# Altium schematic sheet SCH_WINGLET_BMU.SchDoc: Winglet BMU
size B; DrawnBy: HCAdam; Organization: Aerospace Village; DocumentNumber: WINGLET; Revision: A; SheetNumber: 1; SheetTotal: 10
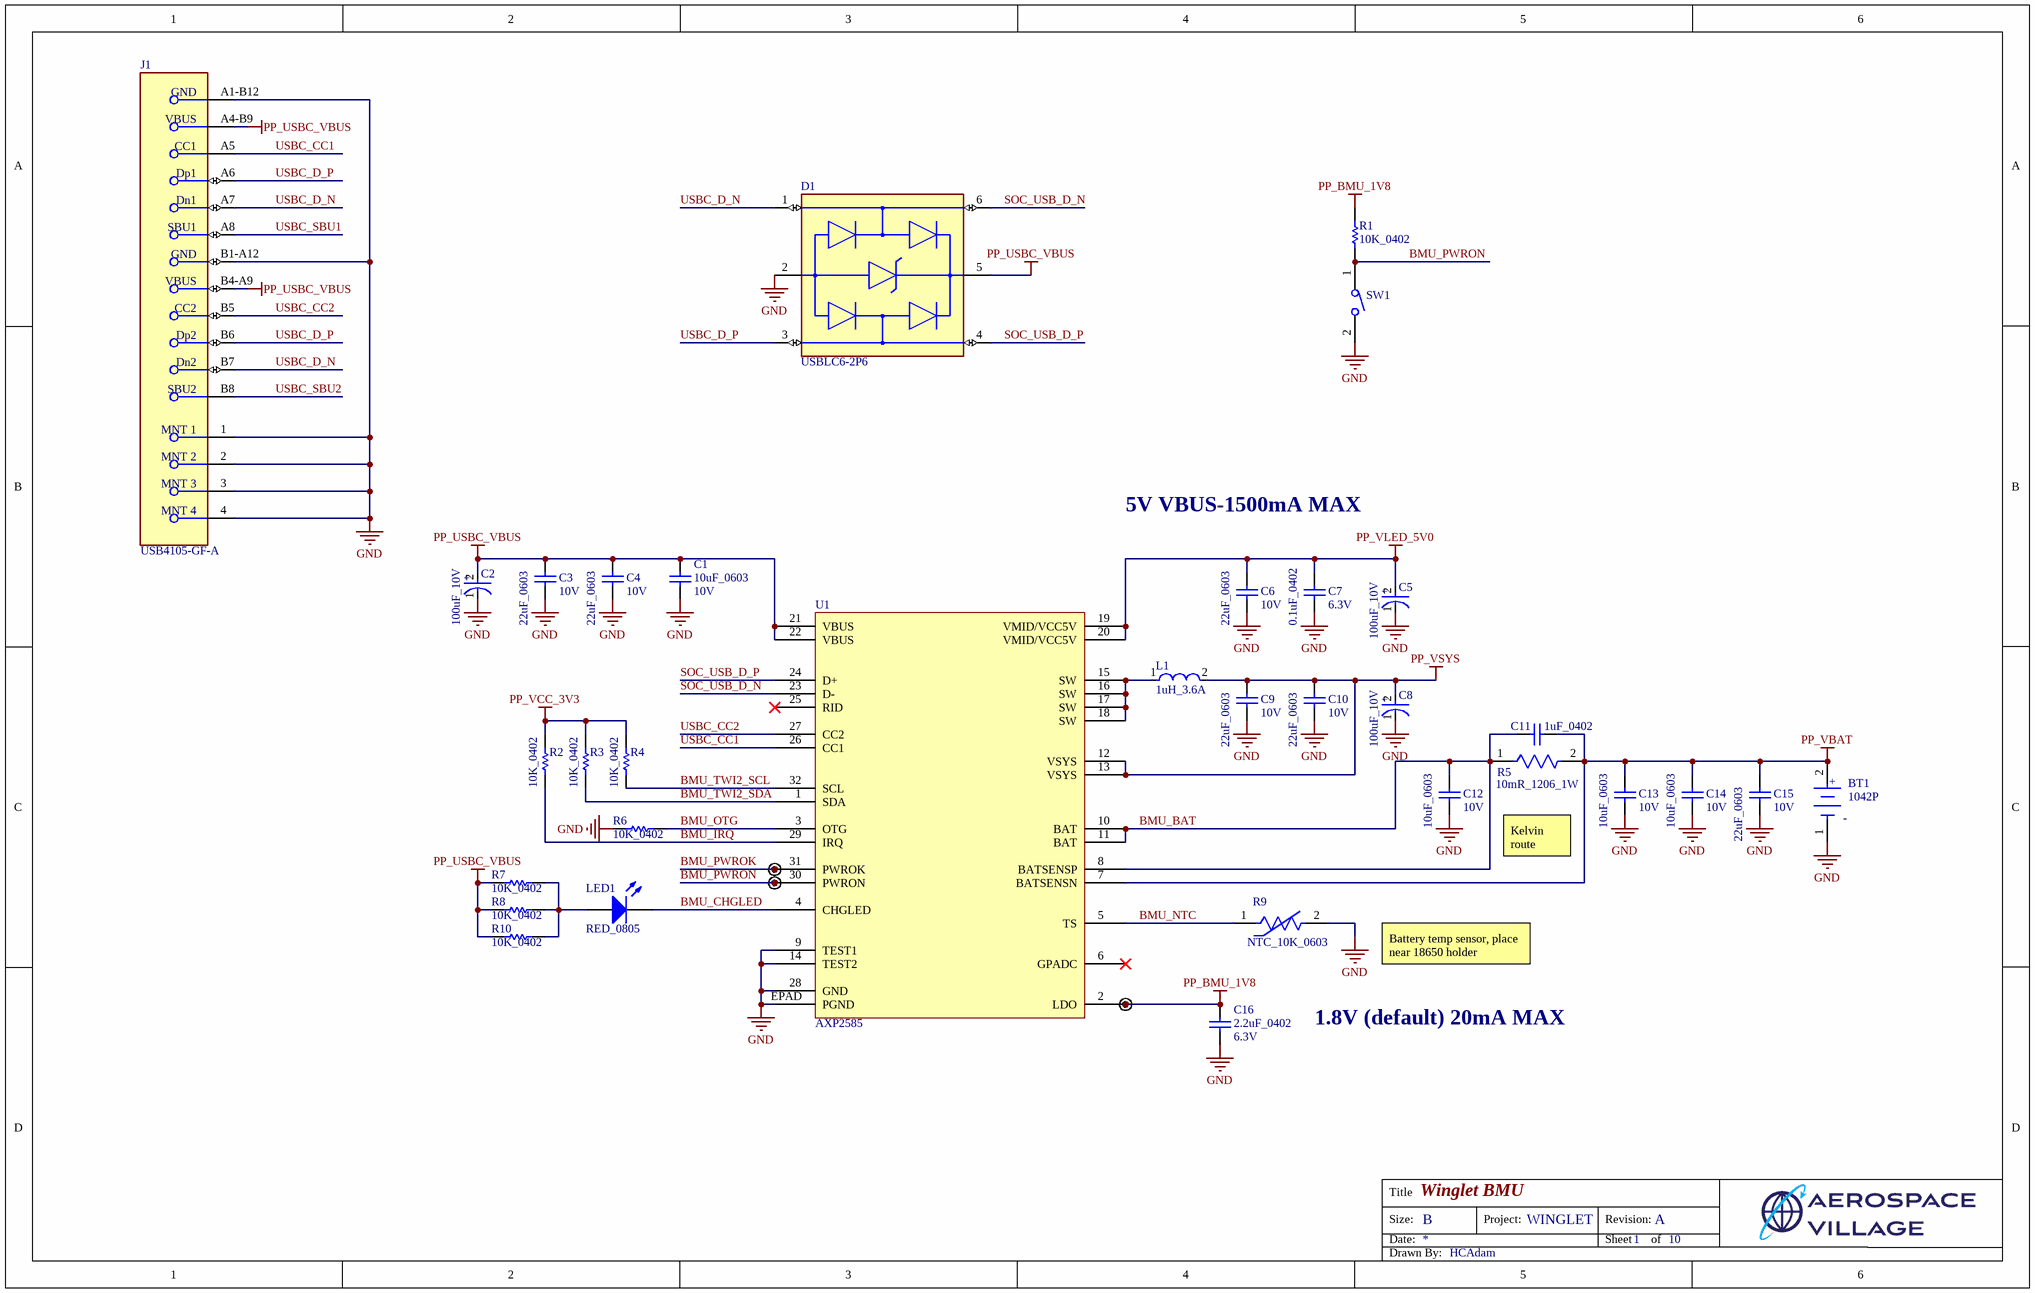
[diagram p0: SCH_WINGLET_BMU.SchDoc]

## Parts
BT1  1042P  [FP-1042P-MFG]
C1  10uF_0603  Voltage Rating: 10V  [CAPC1609X100X15NL20]
C2  100uF_10V  [FP-TAJB-MFG]
C3  22uF_0603  Voltage Rating: 10V  [CAPC1608X100X20NL10]
C4  22uF_0603  Voltage Rating: 10V  [CAPC1608X100X20NL10]
C5  100uF_10V  [FP-TAJB-MFG]
C6  22uF_0603  Voltage Rating: 10V  [CAPC1608X100X20NL10]
C7  0.1uF_0402  Voltage Rating: 6.3V  [CAPC1005X56X25NL10T15]
C8  100uF_10V  [FP-TAJB-MFG]
C9  22uF_0603  Voltage Rating: 10V  [CAPC1608X100X20NL10]
C10  22uF_0603  Voltage Rating: 10V  [CAPC1608X100X20NL10]
C11  1uF_0402  [CAPC1005X55X25NL5T10]
C12  10uF_0603  Voltage Rating: 10V  [CAPC1609X100X15NL20]
C13  10uF_0603  Voltage Rating: 10V  [CAPC1609X100X15NL20]
C14  10uF_0603  Voltage Rating: 10V  [CAPC1609X100X15NL20]
C15  22uF_0603  Voltage Rating: 10V  [CAPC1608X100X20NL10]
C16  2.2uF_0402  Voltage Rating: 6.3V  [CAPC1005X55X25NL05T10]
D1  USBLC6-2P6  [FP-SOT-666-MFG]
J1  USB4105-GF-A  [FP-USB4105-GF-A-MFG]
L1  1uH_3.6A  [FP-NRS5020-MFG]
LED1  RED_0805  [0805_A]
R1  10K_0402  [RESC1005X40X25NL05T05]
R2  10K_0402  [RESC1005X40X25NL05T05]
R3  10K_0402  [RESC1005X40X25NL05T05]
R4  10K_0402  [RESC1005X40X25NL05T05]
R5  10mR_1206_1W  [FP-ERJ8BW-IPC_B]
R6  10K_0402  [RESC1005X40X25NL05T05]
R7  10K_0402  [RESC1005X40X25NL05T05]
R8  10K_0402  [RESC1005X40X25NL05T05]
R9  NTC_10K_0603  [FP-ERTJ1-IPC_C]
R10  10K_0402  [RESC1005X40X25NL05T05]
SW1  GT-TC029B-H025-L1N  [LCSC_SMD_SW_SMALL]  (value not drawn)
TP1  TESTPOINT  [TESTPOINT-0.7MM-SINGLE-LAYER]  (value not drawn)  (no BOM)
TP2  TESTPOINT  [TESTPOINT-0.7MM-SINGLE-LAYER]  (value not drawn)  (no BOM)
TP3  TESTPOINT  [TESTPOINT-0.7MM-SINGLE-LAYER]  (value not drawn)  (no BOM)
U1  AXP2585  [QFN127P600-8N]

## Nets
GND: BT1.1(C) C1.1 C2.1(C) C3.1 C4.1 C5.1(C) C6.1 C7.1 C8.1(C) C9.1 C10.1 C12.1 C13.1 C14.1 C15.1 C16.1 D1.2(GND) J1.1(MNT_1) J1.2(MNT_2) J1.3(MNT_3) J1.4(MNT_4) J1.A1-B12(GND) J1.B1-A12(GND) R6.1 R9.2 SW1.2 U1.9(TEST1) U1.14(TEST2) U1.28(GND) U1.EPAD(PGND)
PP_BMU_1V8: C16.2 R1.1 TP3.1 U1.2(LDO)
PP_USBC_VBUS: C1.2 C2.2(A) C3.2 C4.2 D1.5(VBUS) J1.A4-B9(VBUS) J1.B4-A9(VBUS) R7.2 R8.2 R10.2 U1.21(VBUS) U1.22(VBUS)
PP_VBAT: BT1.2(A) C11.1 C13.2 C14.2 C15.2 R5.2 U1.7(BATSENSN)
PP_VCC_3V3: R2.1 R3.1 R4.1
PP_VLED_5V0: C5.2(A) C6.2 C7.2 U1.19(VMID/VCC5V) U1.20(VMID/VCC5V)
PP_VSYS: C8.2(A) C9.2 C10.2 L1.2 U1.12(VSYS) U1.13(VSYS)
BMU_BAT: C11.2 C12.2 R5.1 U1.8(BATSENSP) U1.10(BAT) U1.11(BAT)
BMU_CHGLED: LED1.1(K) U1.4(CHGLED)
BMU_IRQ: R2.2 U1.29(IRQ)
BMU_NTC: R9.1 U1.5(TS)
BMU_OTG: R6.2 U1.3(OTG)
BMU_PWROK: TP1.1 U1.31(PWROK)
BMU_PWRON: R1.2 SW1.1 TP2.1 U1.30(PWRON)
BMU_TWI2_SCL: R4.2 U1.32(SCL)
BMU_TWI2_SDA: R3.2 U1.1(SDA)
SOC_USB_D_N: D1.6(I/O1) U1.23(D-)
SOC_USB_D_P: D1.4(I/O2) U1.24(D+)
USBC_CC1: J1.A5(CC1) U1.26(CC1)
USBC_CC2: J1.B5(CC2) U1.27(CC2)
USBC_D_N: D1.1(I/O1) J1.A7(Dn1) J1.B7(Dn2)
USBC_D_P: D1.3(I/O2) J1.A6(Dp1) J1.B6(Dp2)
USBC_SBU1: J1.A8(SBU1)
USBC_SBU2: J1.B8(SBU2)
NetL1_1: L1.1 U1.15(SW) U1.16(SW) U1.17(SW) U1.18(SW)
NetLED1_2: LED1.2(A) R7.1 R8.1 R10.1

Not connected (* = marked no-connect by the designer): U1 6(GPADC)* 25(RID)*

## Notes on the sheet
- 5V VBUS-1500mA MAX
- Kelvin route
- Battery temp sensor, place near 18650 holder
- 1.8V (default) 20mA MAX
- Title
- Size:
- Date:
- B
- Project:
- Revision:
- Sheet
- of
- Drawn By:
- (in symbol CMP-04424-000366-1) +
- (in symbol CMP-19636-000019-1) +; -

## Library data of the parts
BT1 = CMP-19636-000019-1: BATTERY HOLDER 18650 SMD TAB; Number of Cells: 1; Max Operating Temperature: 145°C; Termination: SMD/SMT; Mount: Surface Mount; Min Operating Temperature: -50°C; Package Quantity: 200; Packaging: Tray; Lead Free: Lead Free
C1 C12-C14 = CMP-2006-00191-1: Part Number: TACL106M006XTA; Manufacturer: AVX Interconnect / Elco
C2 C5 C8 = CMP-04424-000366-1: 100uF 10V ±10% 1.7Ω SMD CASE-B (3528) Tantalum Capacitor; Voltage Rating (DC): 6.3V; ESR (Equivalent Series Resistance): 1.7R; Polarity: Polar; Leakage Current: 6.3uA; Height: 1.9mm; Depth: 2.8mm; Length: 3.5mm; Min Operating Temperature: -55°C; Width: 2.8mm; Series: TAJ; Lead Free: Lead Free; Case/Package: 1210; Voltage: 6.3V; Mount: Surface Mount; Tolerance: 10%; Capacitance: 100uF; Radiation Hardening: No; REACH SVHC: No SVHC; Voltage Rating: 6.3V; Case Code (Metric): 3528; Dissipation Factor: 10%; Packaging: Tape and Reel; Construction: Flat; Features: General Purpose; Max Operating Temperature: 125°C; RoHS Compliant: Yes; Package Quantity: 1; Dielectric Material: Tantalum; Termination: SMD/SMT; Case Code (Imperial): 1210; Height - Seated (Max): 0.083inch
C3 C4 C6 C9 C10 C15 = CMP-2000-05441-1: Chip Capacitor, 22 uF, +/- 20%, 10 V, -55 to 85 degC, 0603 (1608 Metric), RoHS, Tape and Reel / PN: C1608X5R1A226M080AC; Manufacturer: TDK; PCN Part Number: MLCCPartNumberChange30/Nov/2012; Product Training Modules: CSeriesGeneralApplicationsSEAT,CCV,andTVCLDesignToolsGuidetoReplacinganElectrolyticCapacitorwithanMLCC; Other Names: 445-9077-1; Design Resources: 20WNon-IsolatedBuckLEDDriverUsingPLLNK460KG; Online Catalog: CSeries,GeneralPurpose; Capacitance: 22µF; Temperature Coefficient: X5R; Kits: 445-9014-KIT-ND-KITMLCC100PF-22UF060310-50V; Packaging: CutTape(CT); Standard Package: 1; Package / Case: 0603(1608Metric); Lead Style: -; Features: -; Ratings: -; Voltage - Rated: 10V; Operating Temperature: -55degC~85degC; Applications: GeneralPurpose; Package Reference: 603; Datasheet URL: http://download.siliconexpert.com/pdfs/2015/4/21/15/54/45/779/tdk_/manual/37024850441143360mlcc_commercial_general_en.pdf; Datasheet Version: Mar-15; Mounting Type: SurfaceMount,MLCC; Lead Spacing: -; Size / Dimension: 0.063"Lx0.031"W(1.60mmx0.80mm); Height - Seated (Max): -; Package Description: 2-Pin Surface Mount Device, Body 1.6 x 0.8 mm; Manufacturer URL: http://www.tdk.com/; RoHS Information: RoHSCertificate-MLCC; Tolerance: ±20%; Series: C; Thickness (Max): 0.035"(0.90mm); Family: CeramicCapacitors; Category: Capacitors
C7 = CMP-2008-02743-1: 04026D104KAT2A; Manufacturer: AVX Interconnect / Elco; Part Number: 04026D104KAT2A
C11 = CMP-1662-00020-1: Chip Capacitor, 1 uF, +/- 10%, 6.3 V, -55 to 85 degC, 0402 (1005 Metric), RoHS, Tape and Reel / GRM155R60J105KE19D; Voltage Rating (DC): 3 V; Type (Capacitors): X5R; Voltage Rating: 6.3 V; Capacitance: 1 uF; ComponentLink2Description: Datasheet; ComponentLink2URL: http://psearch.en.murata.com/capacitor/product/GRM155R60J105KE19%23.pdf; Max Operating Temperature: 85 degC; Min Operating Temperature: -55 degC; Package Quantity: 10000; Mounting Technology: Surface Mount; ComponentLink1Description: Manufacturer URL; ComponentLink1URL: http://www.murata.com/; PackageDescription: 2-Pin Surface Mount Device, Body 1 x 0.5 mm; Tolerance: 10%; Case/Package: 0402; Mount: Surface Mount; Packaging: Tape and Reel; Case Code (Metric): 1005; Radiation Hardening: No; Width: 0.5 mm; Length: 1 mm; DatasheetVersion: 08/2016; Height: 0.5 mm; PartNumber: GRM155R60J105KE19D; RoHSCompliant: true; Case Code (Imperial): 0402; REACH SVHC: No SVHC; Pins: 2
C16 = CMP-2008-04543-1: GRM155R60J225ME15D; Manufacturer: Murata; Part Number: GRM155R60J225ME15D
D1 = CMP-12225-000058-1: TVS DIODE 5.25V 17V SOT666; Min Breakdown Voltage: 6V; Power Line Protection: Yes; Element Configuration: Dual; Test Current: 1mA; Working Voltage: 5V; Number of Channels: 2; Max Reverse Leakage Current: 150nA; Direction: Unidirectional; Peak Pulse Current: 5A; Number of Elements: 1; Capacitance: 3.5pF; Max Breakdown Voltage: 6V; Height: 0.6mm; Depth: 1.3mm; Contact Plating: Tin; Reverse Breakdown Voltage: 6V; REACH SVHC: No SVHC; Operating Supply Voltage: 5V; Width: 1.3mm; Max Operating Temperature: 125°C; Reverse Standoff Voltage: 5V; ESD Protection: Yes; Package Quantity: 1; Termination: SMD/SMT; Length: 1.7mm; Leakage Current: 150nA; Number of Bidirectional Channels: 2; Case/Package: SOT-666; Min Operating Temperature: -40°C; Number of Pins: 6; Clamping Voltage: 17V; Breakdown Voltage: 6V; Lead Free: Lead Free; Radiation Hardening: No; Packaging: Tape and Reel; Mount: Surface Mount; Polarity: Unidirectional
J1 = CMP-245163-000001-1: CONN RCPT USB2.0 TYPEC 5A; Manufacturer: GCT; Voltage Rating: 20V; Is Female: yes; Current Rating: 5/6.25/1.25/0.25A; Number Of Contacts: 16; Conn Orientation: Right Angle; Device Class L1: Connectors; Category: Conn; Lead Free: Yes; RoHS: TRUE; Temperature Range High: +85°C; Digikey Description: CONN RCPT USB2.0 TYPEC 5A; Device Class L3: unset; ComponentLink2Description: Datasheet; Manufacturer Part Number: USB4105-GF-A; Package: 0; Usb Standard: USB 2.0; Device Class L2: USB Connectors; Automotive: No; Temperature Range Low: -40°C; Height: 3.46mm; Temperature: -40°C to +85°C; Contact Material: Gold,Nickel; ComponentLink2URL: https://gct.co/files/drawings/usb4105.pdf; Octopart: https://octopart.com/usb4105-gf-a-gct-106627878
L1 = CMP-14484-001289-1: Shielded Wirewound Inductor 1uH 30% 3.71A 25.2mΩ SMD / NRS5020T1R0NMGJ; RMS Current (Irms): 3.6A; Test Frequency: 100kHz; Core Material: Ferrite; DC Resistance (DCR): 25.2mR; Saturation Current: 4A; Self Resonant Frequency: 81MHz; Inductance: 1uH; Lead Free: Lead Free; Length: 4.9mm; Height - Seated (Max): 0.079inch; Max Operating Temperature: 125°C; Tolerance: 30%; Packaging: Tape and Reel; Halogen Free: Halogen Free; Mount: Surface Mount; Package Quantity: 800; Current Rating: 3.6A; RoHS Compliant: Yes; Resistor Type: Wirewound; Radiation Hardening: No; Min Operating Temperature: -25°C; Inductance Tolerance: 30%; Width: 0.193inch; Lead Pitch: 3.3mm; Series: NRS; Max DC Current: 4A; Number of Pins: 2; Case/Package: 5020; Depth: 5.1mm; Termination: SMD/SMT; Shielding: Shielded; Height: 2mm
LED1 = CMP-1426-00007-1: LED RED 0805; PartNumber: 150080GS75000; Manufacturer: Wuerth Elektronik; Color: Green; PackageReference: 0805_A; ComponentLink2URL: http://katalog.we-online.com/led/datasheet/150080GS75000.pdf; ComponentLink1URL: http://www.we-online.com; ComponentLink1Description: Manufacturer URL; ComponentLink2Description: Datasheet
R1-R4 R6-R8 R10 = CMP-2000-07588-1: Chip Resistor, 10 KOhm, +/- 1%, 0.1 W, -55 to 155 degC, 0402 (1005 Metric), RoHS, Tape and Reel / ERJ2RKF1002X; Manufacturer: Panasonic; Power Rating: 100mW; Voltage Rating: 50V; Resistance: 10KOhm; Case\/Package: 0402; Temperature Coefficient: 100ppm\/degreesC; RoHSCompliant: True; Lead Free: LeadFree; Package Quantity: 1; Contact Plating: Tin; Length: 1mm; Radiation Hardening: No; REACH SVHC: NoSVHC; Max Operating Temperature: 155degC; Depth: 0.5mm; Case Code (Imperial): 0402; Military Standard: Not; Package Description: 2-Pin Surface Mount Device, Body 1 x 0.5 mm; Termination: SMD/SMT; Case Code (Metric): 1005; Height: 0.35mm; Packaging: TapeandReel; Voltage Rating (DC): 50V; Package Reference: 402; Number of Pins: 2; Tolerance: 1%; Mounting Technology: SurfaceMount; Width: 0.02inch; Mount: SurfaceMount; Datasheet URL: https://industrial.panasonic.com/cdbs/www-data/pdf/RDA0000/AOA0000C304.pdf; Composition: ThickFilm; Datasheet Version: 02/2017; Manufacturer URL: http://www.panasonic.com/; Max Power Dissipation: 100mW; Number of Terminations: 2; Min Operating Temperature: -55degC
R5 = CMP-2003-00764-2: RES 0.01 OHM 1% 1W 1206 / ERJ-8BWFR010V; Temperature Coefficient: 200ppm/°C; Resistance: 10mR; Mount: Surface Mount; Package Quantity: 1; Construction: Rectangular; Technology: THICK FILM; Contact Plating: Tin; Length: 3.2mm; Features: Automotive AEC-Q200; Lead Free: Lead Free; Military Standard: Not; Resistance Tolerance: 1%; Case/Package: 1206; Width: 1.6mm; Case Code (Imperial): 1206; Max Operating Temperature: 155°C; Min Operating Temperature: -55°C; Max Power Dissipation: 1W; Tolerance: 1%; Height: 0.65mm; Termination: SMD/SMT; REACH SVHC: No SVHC; Radiation Hardening: No; Depth: 1.6mm; Series: ERJ; RoHS Compliant: Yes; Packaging: Tape and Reel; Number of Terminations: 2; Resistor Type: Thick Film; Size Code: 1206; Power Rating: 1W; Case Code (Metric): 3216
R9 = CMP-05419-000002-1: THERMISTOR NTC 10KOHM 3380K 0603 / ERT-J1VG103JA; Tolerance: 5%; Resistance: 10kR; Max Power Dissipation: 100mW; Accuracy: 1%; Case Code (Metric): 1608; Lead Free: Lead Free; Max Operating Temperature: 125°C; Termination: SMD/SMT; Radiation Hardening: No; Series: ERT-J; Length: 1.6mm; Depth: 0.8mm; RoHS Compliant: Yes; Number of Pins: 2; Case/Package: 0603; Packaging: Tape and Reel; Width: 800um; REACH SVHC: No SVHC; Min Operating Temperature: -40°C; Package Quantity: 4000; Case Code (Imperial): 0603; Resistance Tolerance: 5%; Mount: Surface Mount
SW1 = GT-TC029B-H025-L1N: SMD SPST Tactile Switch / C843669
TP1-TP3 = TP_07: TESTPOINT SINGLE LAYER 0.7MM; AEC-Q: Yes; PPAP: Unknown; Selective Soldering: No; Value: Unknown; RoHS: Yes; Package: BOARD_FEATURE; Washable: Yes; Mounting: Unknown
U1 = AXP2585: AXP2585 Single Cell NVDC BMU with E-gauge